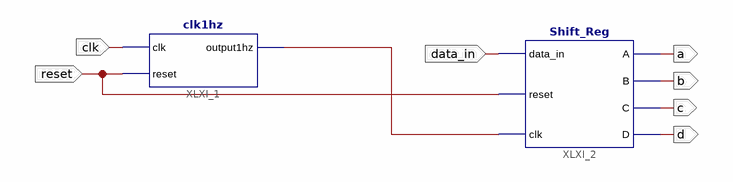
[diagram p0: schematic sheet 1]
// Xilinx ISE schematic top.sch (spartan3e) as structural Verilog: 2 symbols, 7 ports
module top (
  input  data_in,
  input  clk,
  input  reset,
  output a,
  output b,
  output c,
  output d
);

  wire XLXN_1;

  clk1hz XLXI_1 (.clk(clk), .reset(reset), .output1hz(XLXN_1));
  Shift_Reg XLXI_2 (.data_in(data_in), .reset(reset), .clk(XLXN_1), .A(a), .B(b), .C(c), .D(d));
endmodule
